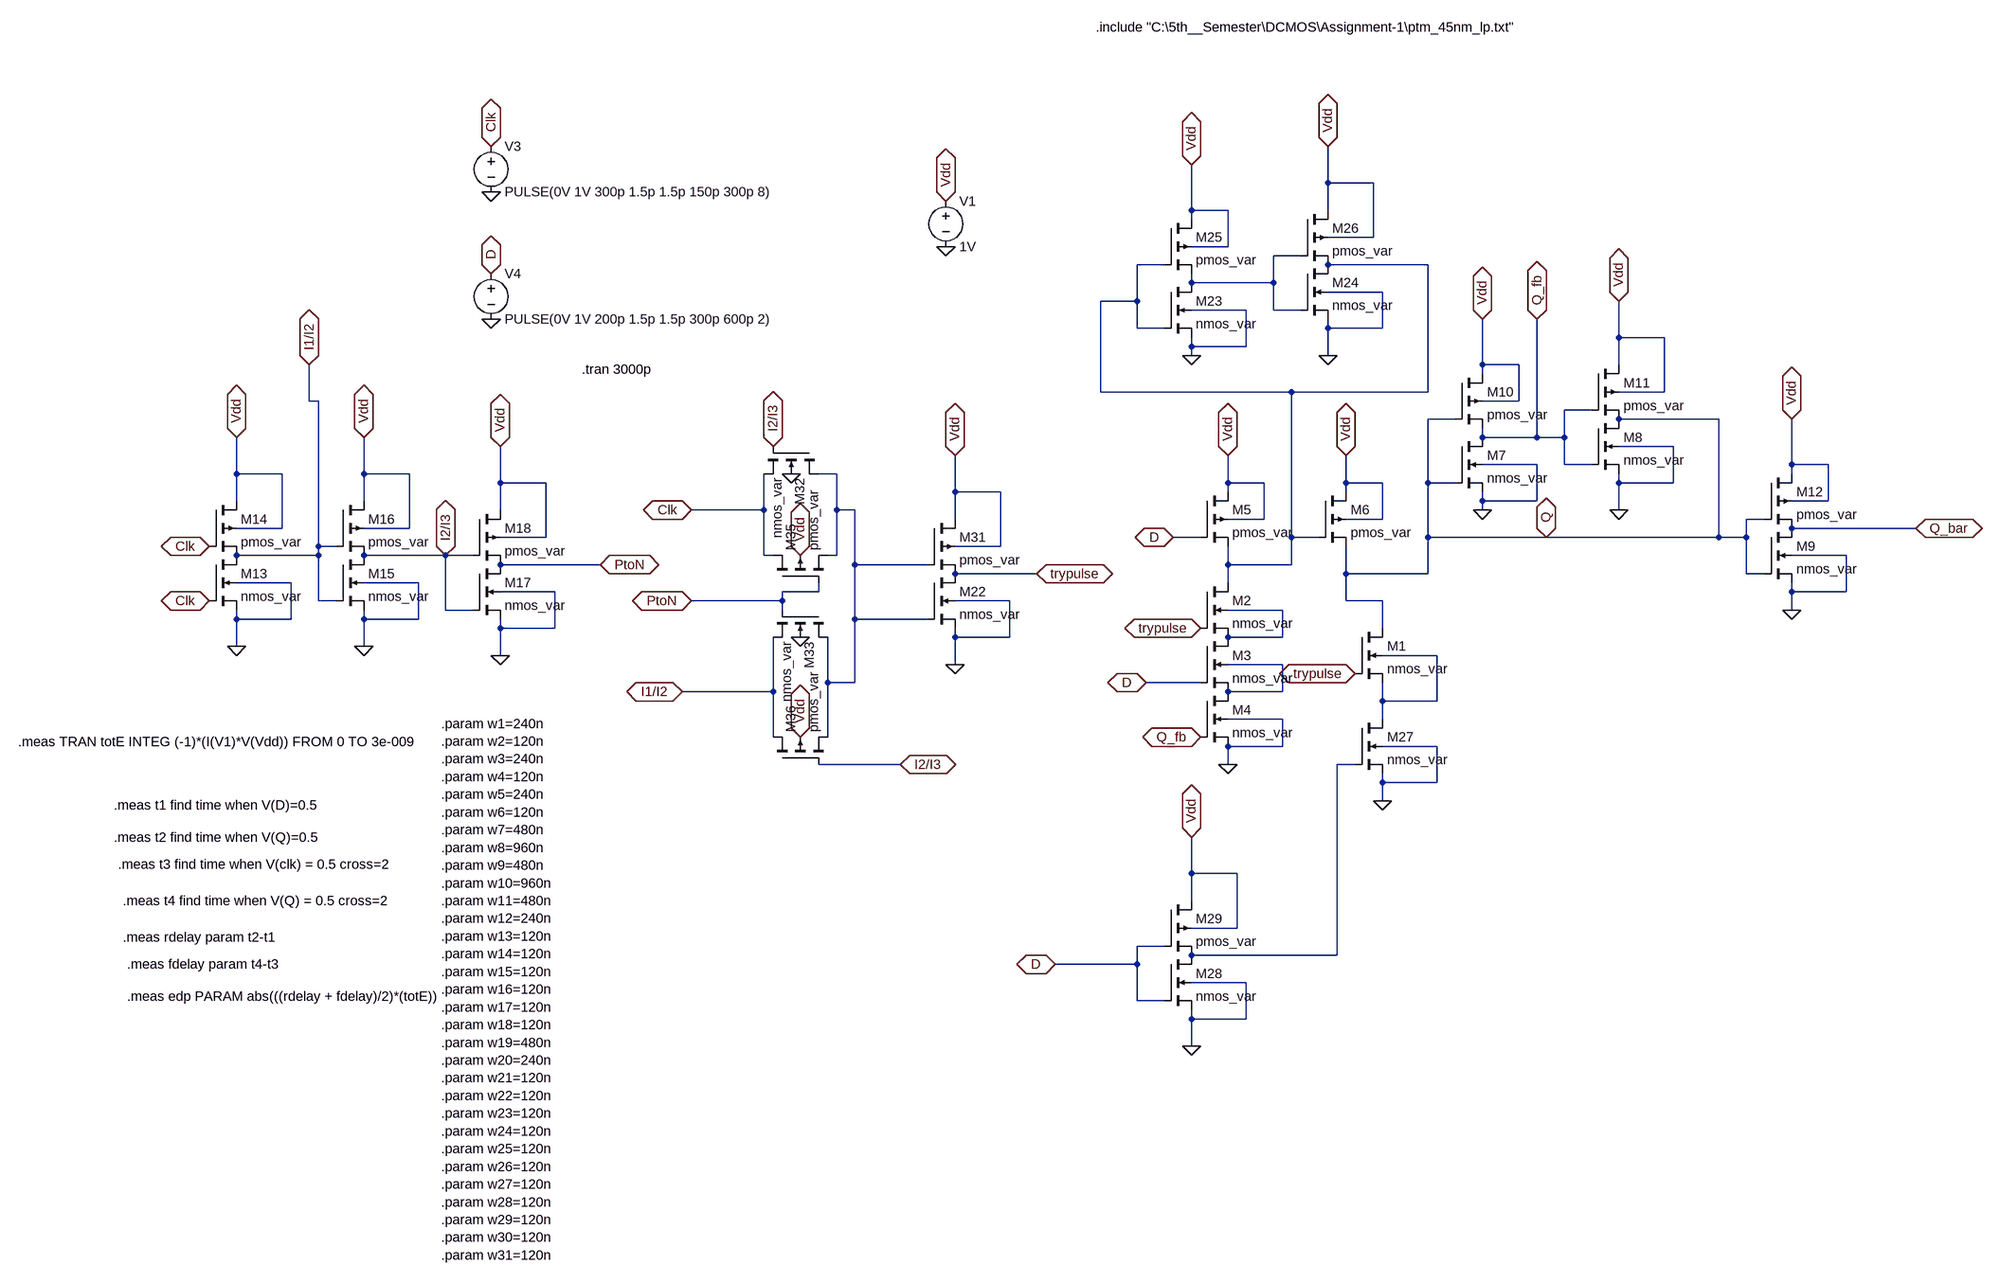
[diagram p0: schematic Project_SCDFF.asc]
Project_SCDFF.asc, the LTspice schematic file:
Version 4
SHEET 1 1444 1588
WIRE 224 -720 224 -784
WIRE 304 -720 224 -720
WIRE -16 -672 -16 -752
WIRE 48 -672 -16 -672
WIRE 224 -672 224 -720
WIRE -16 -656 -16 -672
WIRE 304 -624 304 -720
WIRE 304 -624 224 -624
WIRE 48 -608 48 -672
WIRE 48 -608 -16 -608
WIRE 176 -592 128 -592
WIRE -64 -576 -112 -576
WIRE 400 -576 224 -576
WIRE -16 -544 -16 -560
WIRE 128 -544 128 -592
WIRE 128 -544 -16 -544
WIRE 320 -528 224 -528
WIRE -112 -512 -112 -576
WIRE -112 -512 -176 -512
WIRE 80 -496 -16 -496
WIRE 128 -496 128 -544
WIRE 176 -496 128 -496
WIRE -112 -464 -112 -512
WIRE -64 -464 -112 -464
WIRE 224 -464 224 -480
WIRE 320 -464 320 -528
WIRE 320 -464 224 -464
WIRE 736 -448 736 -512
WIRE 816 -448 736 -448
WIRE -16 -432 -16 -448
WIRE 80 -432 80 -496
WIRE 80 -432 -16 -432
WIRE -16 -416 -16 -432
WIRE 224 -416 224 -464
WIRE 496 -400 496 -480
WIRE 560 -400 496 -400
WIRE 736 -400 736 -448
WIRE 496 -384 496 -400
WIRE -176 -352 -176 -512
WIRE 160 -352 -176 -352
WIRE 400 -352 400 -576
WIRE 400 -352 160 -352
WIRE 816 -352 816 -448
WIRE 816 -352 736 -352
WIRE -1568 -336 -1568 -400
WIRE -1552 -336 -1568 -336
WIRE 560 -336 560 -400
WIRE 560 -336 496 -336
WIRE 688 -320 640 -320
WIRE 448 -304 400 -304
WIRE 912 -304 736 -304
WIRE 496 -272 496 -288
WIRE 592 -272 592 -480
WIRE 592 -272 496 -272
WIRE 640 -272 640 -320
WIRE 640 -272 592 -272
WIRE 832 -256 736 -256
WIRE 592 -224 496 -224
WIRE 640 -224 640 -272
WIRE 688 -224 640 -224
WIRE 1040 -224 1040 -304
WIRE 1104 -224 1040 -224
WIRE -1696 -208 -1696 -272
WIRE -1616 -208 -1696 -208
WIRE -1472 -208 -1472 -272
WIRE -1392 -208 -1472 -208
WIRE -640 -208 -672 -208
WIRE 1040 -208 1040 -224
WIRE -1232 -192 -1232 -256
WIRE -1152 -192 -1232 -192
WIRE 48 -192 48 -240
WIRE 112 -192 48 -192
WIRE 256 -192 256 -240
WIRE 320 -192 256 -192
WIRE 400 -192 400 -304
WIRE 448 -192 400 -192
WIRE 736 -192 736 -208
WIRE 832 -192 832 -256
WIRE 832 -192 736 -192
WIRE -432 -176 -432 -240
WIRE -352 -176 -432 -176
WIRE 48 -176 48 -192
WIRE 256 -176 256 -192
WIRE -1696 -160 -1696 -208
WIRE -1472 -160 -1472 -208
WIRE 496 -160 496 -176
WIRE 592 -160 592 -224
WIRE 592 -160 496 -160
WIRE 1104 -160 1104 -224
WIRE 1104 -160 1040 -160
WIRE -1232 -144 -1232 -192
WIRE -768 -144 -768 -208
WIRE -768 -144 -896 -144
WIRE -640 -144 -640 -208
WIRE -608 -144 -640 -144
WIRE 496 -144 496 -160
WIRE 736 -144 736 -192
WIRE -432 -128 -432 -176
WIRE 112 -128 112 -192
WIRE 112 -128 48 -128
WIRE 320 -128 320 -192
WIRE 320 -128 256 -128
WIRE 992 -128 960 -128
WIRE -1616 -112 -1616 -208
WIRE -1616 -112 -1696 -112
WIRE -1392 -112 -1392 -208
WIRE -1392 -112 -1472 -112
WIRE 1312 -112 1040 -112
WIRE -1152 -96 -1152 -192
WIRE -1152 -96 -1232 -96
WIRE 0 -96 -48 -96
WIRE 160 -96 160 -352
WIRE 208 -96 160 -96
WIRE 400 -96 400 -192
WIRE 608 -96 400 -96
WIRE 912 -96 912 -304
WIRE 912 -96 608 -96
WIRE 960 -96 960 -128
WIRE 960 -96 912 -96
WIRE -1552 -80 -1552 -336
WIRE -1520 -80 -1552 -80
WIRE -352 -80 -352 -176
WIRE -352 -80 -432 -80
WIRE -1552 -64 -1552 -80
WIRE -1552 -64 -1696 -64
WIRE -1328 -64 -1472 -64
WIRE -1280 -64 -1328 -64
WIRE -768 -64 -768 -144
WIRE -752 -64 -768 -64
WIRE -640 -64 -640 -144
WIRE -640 -64 -656 -64
WIRE 1136 -64 1040 -64
WIRE -1056 -48 -1232 -48
WIRE -608 -48 -608 -144
WIRE -480 -48 -608 -48
WIRE 48 -48 48 -80
WIRE 160 -48 160 -96
WIRE 160 -48 48 -48
WIRE -288 -32 -432 -32
WIRE 256 -32 256 -80
WIRE 400 -32 400 -96
WIRE 400 -32 256 -32
WIRE 960 -32 960 -96
WIRE 992 -32 960 -32
WIRE -1600 -16 -1696 -16
WIRE -1376 -16 -1472 -16
WIRE 48 -16 48 -48
WIRE -1136 0 -1232 0
WIRE -672 0 -672 -16
WIRE -672 0 -736 0
WIRE 1040 0 1040 -16
WIRE 1136 0 1136 -64
WIRE 1136 0 1040 0
WIRE -1552 16 -1552 -64
WIRE -1520 16 -1552 16
WIRE -736 16 -736 0
WIRE -736 16 -896 16
WIRE -336 16 -432 16
WIRE 256 16 256 -32
WIRE 320 16 256 16
WIRE -1328 32 -1328 -64
WIRE -1280 32 -1328 32
WIRE -736 32 -736 16
WIRE 144 32 48 32
WIRE 1040 32 1040 0
WIRE -1696 48 -1696 32
WIRE -1600 48 -1600 -16
WIRE -1600 48 -1696 48
WIRE -1472 48 -1472 32
WIRE -1376 48 -1376 -16
WIRE -1376 48 -1472 48
WIRE -608 48 -608 -48
WIRE -480 48 -608 48
WIRE -1232 64 -1232 48
WIRE -1136 64 -1136 0
WIRE -1136 64 -1232 64
WIRE 320 64 320 16
WIRE -432 80 -432 64
WIRE -336 80 -336 16
WIRE -336 80 -432 80
WIRE 144 80 144 32
WIRE 144 80 48 80
WIRE -1696 96 -1696 48
WIRE -1472 96 -1472 48
WIRE -1232 112 -1232 64
WIRE 416 112 320 112
WIRE -432 128 -432 80
WIRE 144 128 48 128
WIRE -656 160 -656 80
WIRE -608 160 -608 48
WIRE -608 160 -656 160
WIRE 0 160 -96 160
WIRE -752 176 -752 80
WIRE -752 176 -912 176
WIRE 144 176 144 128
WIRE 144 176 48 176
WIRE 320 192 320 160
WIRE 416 192 416 112
WIRE 416 192 320 192
WIRE 144 224 48 224
WIRE 320 224 320 192
WIRE -752 256 -752 176
WIRE -656 256 -656 160
WIRE 144 272 144 224
WIRE 144 272 48 272
WIRE 416 272 320 272
WIRE -528 304 -672 304
WIRE 48 304 48 272
WIRE 272 304 240 304
WIRE 320 336 320 320
WIRE 416 336 416 272
WIRE 416 336 320 336
WIRE 320 368 320 336
WIRE -16 496 -16 432
WIRE 64 496 -16 496
WIRE -16 544 -16 496
WIRE 64 592 64 496
WIRE 64 592 -16 592
WIRE -64 624 -112 624
WIRE 240 640 240 304
WIRE 240 640 -16 640
WIRE -112 656 -112 624
WIRE -112 656 -256 656
WIRE 80 688 -16 688
WIRE -112 720 -112 656
WIRE -64 720 -112 720
WIRE -16 752 -16 736
WIRE 80 752 80 688
WIRE 80 752 -16 752
WIRE -16 800 -16 752
FLAG 48 304 0
FLAG -1248 -784 Clk
IOPIN -1248 -784 BiDir
FLAG -448 -688 Vdd
IOPIN -448 -688 BiDir
FLAG 48 -240 Vdd
IOPIN 48 -240 BiDir
FLAG 256 -240 Vdd
IOPIN 256 -240 BiDir
FLAG -448 -608 0
FLAG 496 -144 0
FLAG 496 -480 Vdd
IOPIN 496 -480 BiDir
FLAG 736 -512 Vdd
IOPIN 736 -512 BiDir
FLAG 1040 -304 Vdd
IOPIN 1040 -304 BiDir
FLAG 736 -144 0
FLAG 1040 32 0
FLAG 592 -480 Q_fb
IOPIN 592 -480 BiDir
FLAG 0 256 Q_fb
IOPIN 0 256 BiDir
FLAG 1312 -112 Q_bar
IOPIN 1312 -112 BiDir
FLAG 608 -96 Q
IOPIN 608 -96 BiDir
FLAG -1696 -272 Vdd
IOPIN -1696 -272 BiDir
FLAG -1696 96 0
FLAG -1472 -272 Vdd
IOPIN -1472 -272 BiDir
FLAG -1472 96 0
FLAG -1232 -256 Vdd
IOPIN -1232 -256 BiDir
FLAG -1232 112 0
FLAG -1744 -80 Clk
IOPIN -1744 -80 BiDir
FLAG -1744 16 Clk
IOPIN -1744 16 BiDir
FLAG -1248 -704 0
FLAG -1248 -560 D
IOPIN -1248 -560 BiDir
FLAG -1248 -480 0
FLAG -16 -416 0
FLAG -16 -752 Vdd
IOPIN -16 -752 BiDir
FLAG 224 -784 Vdd
IOPIN 224 -784 BiDir
FLAG 224 -416 0
FLAG 320 368 0
FLAG -16 432 Vdd
IOPIN -16 432 BiDir
FLAG -16 800 0
FLAG -256 656 D
IOPIN -256 656 BiDir
FLAG -96 160 D
IOPIN -96 160 BiDir
FLAG -48 -96 D
IOPIN -48 -96 BiDir
FLAG -1328 -64 I2/I3
IOPIN -1328 -64 BiDir
FLAG -752 -256 I2/I3
IOPIN -752 -256 BiDir
FLAG -432 -240 Vdd
IOPIN -432 -240 BiDir
FLAG -432 128 0
FLAG -288 -32 trypulse
IOPIN -288 -32 BiDir
FLAG 0 64 trypulse
IOPIN 0 64 BiDir
FLAG 272 144 trypulse
IOPIN 272 144 BiDir
FLAG -896 16 PtoN
IOPIN -896 16 BiDir
FLAG -528 304 I2/I3
IOPIN -528 304 BiDir
FLAG -896 -144 Clk
IOPIN -896 -144 BiDir
FLAG -1568 -400 I1/I2
IOPIN -1568 -400 BiDir
FLAG -912 176 I1/I2
IOPIN -912 176 BiDir
FLAG -1056 -48 PtoN
IOPIN -1056 -48 BiDir
FLAG -704 256 Vdd
IOPIN -704 256 BiDir
FLAG -704 -64 Vdd
IOPIN -704 -64 BiDir
FLAG -720 -208 0
FLAG -704 80 0
SYMBOL nmos4 0 -16 R0
SYMATTR InstName M2
SYMATTR Value nmos_var
SYMATTR Value2 l=45nm w=w16
SYMBOL nmos4 0 80 R0
SYMATTR InstName M3
SYMATTR Value nmos_var
SYMATTR Value2 l=45nm w=w17
SYMBOL nmos4 0 176 R0
SYMATTR InstName M4
SYMATTR Value nmos_var
SYMATTR Value2 l=45nm w=w18
SYMBOL pmos4 0 -176 R0
SYMATTR InstName M5
SYMATTR Value pmos_var
SYMATTR Value2 l=45nm w=w15
SYMBOL pmos4 208 -176 R0
SYMATTR InstName M6
SYMATTR Value pmos_var
SYMATTR Value2 l=45nm w=w21
SYMBOL voltage -448 -704 R0
WINDOW 123 0 0 Left 0
WINDOW 39 0 0 Left 0
SYMATTR InstName V1
SYMATTR Value 1V
SYMBOL nmos4 448 -272 R0
SYMATTR InstName M7
SYMATTR Value nmos_var
SYMATTR Value2 l=45nm w=w25
SYMBOL nmos4 688 -304 R0
SYMATTR InstName M8
SYMATTR Value nmos_var
SYMATTR Value2 l=45nm w=w27
SYMBOL nmos4 992 -112 R0
SYMATTR InstName M9
SYMATTR Value nmos_var
SYMATTR Value2 l=45nm w=w29
SYMBOL pmos4 448 -384 R0
SYMATTR InstName M10
SYMATTR Value pmos_var
SYMATTR Value2 l=45nm w=w24
SYMBOL pmos4 688 -400 R0
SYMATTR InstName M11
SYMATTR Value pmos_var
SYMATTR Value2 l=45nm w=w26
SYMBOL pmos4 992 -208 R0
SYMATTR InstName M12
SYMATTR Value pmos_var
SYMATTR Value2 l=45nm w=w28
SYMBOL nmos4 -1744 -64 R0
SYMATTR InstName M13
SYMATTR Value nmos_var
SYMATTR Value2 l=45nm w=w2
SYMBOL pmos4 -1744 -160 R0
SYMATTR InstName M14
SYMATTR Value pmos_var
SYMATTR Value2 l=45nm w=w1
SYMBOL nmos4 -1520 -64 R0
SYMATTR InstName M15
SYMATTR Value nmos_var
SYMATTR Value2 l=45nm w=w4
SYMBOL pmos4 -1520 -160 R0
SYMATTR InstName M16
SYMATTR Value pmos_var
SYMATTR Value2 l=45nm w=w3
SYMBOL nmos4 -1280 -48 R0
SYMATTR InstName M17
SYMATTR Value nmos_var
SYMATTR Value2 l=45nm w=w6
SYMBOL pmos4 -1280 -144 R0
SYMATTR InstName M18
SYMATTR Value pmos_var
SYMATTR Value2 l=45nm w=w5
SYMBOL voltage -1248 -800 R0
WINDOW 123 0 0 Left 0
WINDOW 39 0 0 Left 0
SYMATTR InstName V3
SYMATTR Value PULSE(0V 1V 300p 1.5p 1.5p 150p 300p 8)
SYMBOL voltage -1248 -576 R0
WINDOW 123 0 0 Left 0
WINDOW 39 0 0 Left 0
SYMATTR InstName V4
SYMATTR Value PULSE(0V 1V 200p 1.5p 1.5p 300p 600p 2)
SYMBOL nmos4 -64 -544 R0
SYMATTR InstName M23
SYMATTR Value nmos_var
SYMATTR Value2 l=45nm w=w31
SYMBOL nmos4 176 -576 R0
SYMATTR InstName M24
SYMATTR Value nmos_var
SYMATTR Value2 l=45nm w=w14
SYMBOL pmos4 -64 -656 R0
SYMATTR InstName M25
SYMATTR Value pmos_var
SYMATTR Value2 l=45nm w=w30
SYMBOL pmos4 176 -672 R0
SYMATTR InstName M26
SYMATTR Value pmos_var
SYMATTR Value2 l=45nm w=w13
SYMBOL nmos4 272 64 R0
SYMATTR InstName M1
SYMATTR Value nmos_var
SYMATTR Value2 l=45nm w=w22
SYMBOL nmos4 272 224 R0
SYMATTR InstName M27
SYMATTR Value nmos_var
SYMATTR Value2 l=45nm w=w23
SYMBOL nmos4 -64 640 R0
SYMATTR InstName M28
SYMATTR Value nmos_var
SYMATTR Value2 l=45nm w=w20
SYMBOL pmos4 -64 544 R0
SYMATTR InstName M29
SYMATTR Value pmos_var
SYMATTR Value2 l=45nm w=w19
SYMBOL nmos4 -480 -32 R0
SYMATTR InstName M22
SYMATTR Value nmos_var
SYMATTR Value2 l=45nm w=w12
SYMBOL pmos4 -480 -128 R0
SYMATTR InstName M31
SYMATTR Value pmos_var
SYMATTR Value2 l=45nm w=w11
SYMBOL nmos4 -672 -256 R90
SYMATTR InstName M32
SYMATTR Value nmos_var
SYMATTR Value2 l=45nm w=w7
SYMBOL nmos4 -656 32 R90
SYMATTR InstName M33
SYMATTR Value nmos_var
SYMATTR Value2 l=45nm w=w9
SYMBOL pmos4 -752 -16 R270
SYMATTR InstName M35
SYMATTR Value pmos_var
SYMATTR Value2 l=45nm w=w8
SYMBOL pmos4 -752 304 R270
SYMATTR InstName M36
SYMATTR Value pmos_var
SYMATTR Value2 l=45nm w=w10
TEXT -1088 -392 Left 2 !.tran 3000p
TEXT -184 -1008 Left 2 !.include "C:\\5th__Semester\\DCMOS\\Assignment-1\\ptm_45nm_lp.txt"
TEXT -1336 232 Left 2 !.param w1=240n\n.param w2=120n\n.param w3=240n\n.param w4=120n\n.param w5=240n\n.param w6=120n\n.param w7=480n\n.param w8=960n\n.param w9=480n\n.param w10=960n\n.param w11=480n\n.param w12=240n\n.param w13=120n\n.param w14=120n\n.param w15=120n\n.param w16=120n\n.param w17=120n\n.param w18=120n\n.param w19=480n\n.param w20=240n\n.param w21=120n\n.param w22=120n\n.param w23=120n\n.param w24=120n\n.param w25=120n\n.param w26=120n\n.param w27=120n\n.param w28=120n\n.param w29=120n\n.param w30=120n\n.param w31=120n
TEXT -1912 376 Left 2 !.meas t1 find time when V(D)=0.5
TEXT -1912 432 Left 2 !.meas t2 find time when V(Q)=0.5
TEXT -1904 480 Left 2 !.meas t3 find time when V(clk) = 0.5 cross=2
TEXT -1896 544 Left 2 !.meas t4 find time when V(Q) = 0.5 cross=2
TEXT -1896 608 Left 2 !.meas rdelay param t2-t1
TEXT -1888 656 Left 2 !.meas fdelay param t4-t3
TEXT -1888 712 Left 2 !.meas edp PARAM abs(((rdelay + fdelay)/2)*(totE))
TEXT -2080 264 Left 2 !.meas TRAN totE INTEG (-1)*(I(V1)*V(Vdd)) FROM 0 TO 3e-009

The netlist it stands for:
* Project_SCDFF.asc
M2 N002 trypulse N004 N004 nmos_var l=45nm w=w16
M3 N004 D N006 N006 nmos_var l=45nm w=w17
M4 N006 Q_fb 0 0 nmos_var l=45nm w=w18
M5 Vdd D N002 Vdd pmos_var l=45nm w=w15
M6 Vdd N002 Q Vdd pmos_var l=45nm w=w21
V1 Vdd 0 1V
M7 Q_fb Q 0 0 nmos_var l=45nm w=w25
M8 Q Q_fb 0 0 nmos_var l=45nm w=w27
M9 Q_bar Q 0 0 nmos_var l=45nm w=w29
M10 Vdd Q Q_fb Vdd pmos_var l=45nm w=w24
M11 Vdd Q_fb Q Vdd pmos_var l=45nm w=w26
M12 Vdd Q Q_bar Vdd pmos_var l=45nm w=w28
M13 I1/I2 Clk 0 0 nmos_var l=45nm w=w2
M14 Vdd Clk I1/I2 Vdd pmos_var l=45nm w=w1
M15 I2/I3 I1/I2 0 0 nmos_var l=45nm w=w4
M16 Vdd I1/I2 I2/I3 Vdd pmos_var l=45nm w=w3
M17 PtoN I2/I3 0 0 nmos_var l=45nm w=w6
M18 Vdd I2/I3 PtoN Vdd pmos_var l=45nm w=w5
V3 Clk 0 PULSE(0V 1V 300p 1.5p 1.5p 150p 300p 8)
V4 D 0 PULSE(0V 1V 200p 1.5p 1.5p 300p 600p 2)
M23 N001 N002 0 0 nmos_var l=45nm w=w31
M24 N002 N001 0 0 nmos_var l=45nm w=w14
M25 Vdd N002 N001 Vdd pmos_var l=45nm w=w30
M26 Vdd N001 N002 Vdd pmos_var l=45nm w=w13
M1 Q trypulse N005 N005 nmos_var l=45nm w=w22
M27 N005 N007 0 0 nmos_var l=45nm w=w23
M28 N007 D 0 0 nmos_var l=45nm w=w20
M29 Vdd D N007 Vdd pmos_var l=45nm w=w19
M22 trypulse N003 0 0 nmos_var l=45nm w=w12
M31 Vdd N003 trypulse Vdd pmos_var l=45nm w=w11
M32 N003 I2/I3 Clk 0 nmos_var l=45nm w=w7
M33 N003 PtoN I1/I2 0 nmos_var l=45nm w=w9
M35 Clk PtoN N003 Vdd pmos_var l=45nm w=w8
M36 I1/I2 I2/I3 N003 Vdd pmos_var l=45nm w=w10
.model NMOS NMOS
.model PMOS PMOS
.lib standard.mos
.tran 3000p
.include "C:\5th__Semester\DCMOS\Assignment-1\ptm_45nm_lp.txt"
.param w1=240n
.param w2=120n
.param w3=240n
.param w4=120n
.param w5=240n
.param w6=120n
.param w7=480n
.param w8=960n
.param w9=480n
.param w10=960n
.param w11=480n
.param w12=240n
.param w13=120n
.param w14=120n
.param w15=120n
.param w16=120n
.param w17=120n
.param w18=120n
.param w19=480n
.param w20=240n
.param w21=120n
.param w22=120n
.param w23=120n
.param w24=120n
.param w25=120n
.param w26=120n
.param w27=120n
.param w28=120n
.param w29=120n
.param w30=120n
.param w31=120n
.meas t1 find time when V(D)=0.5
.meas t2 find time when V(Q)=0.5
.meas t3 find time when V(clk) = 0.5 cross=2
.meas t4 find time when V(Q) = 0.5 cross=2
.meas rdelay param t2-t1
.meas fdelay param t4-t3
.meas edp PARAM abs(((rdelay + fdelay)/2)*(totE))
.meas TRAN totE INTEG (-1)*(I(V1)*V(Vdd)) FROM 0 TO 3e-009
.backanno
.end